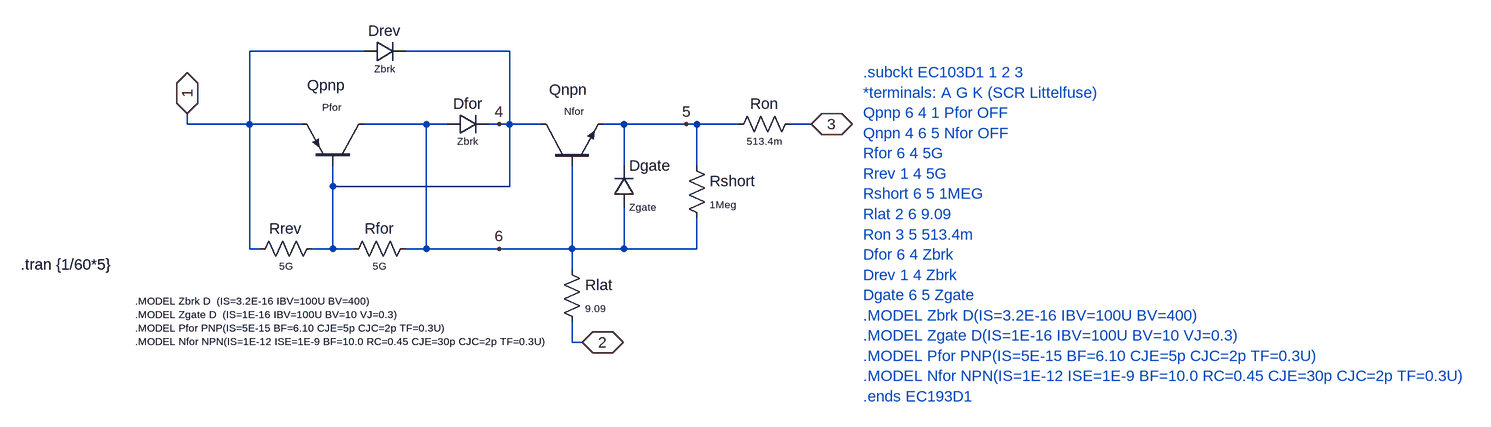
[diagram p0: schematic Littelfuse SCR EC103D1_Subckt.asc]
Littelfuse SCR EC103D1_Subckt.asc, the LTspice schematic file:
Version 4
SHEET 1 2028 680
WIRE 272 16 96 16
WIRE 496 16 336 16
WIRE 0 128 0 112
WIRE 96 128 96 16
WIRE 96 128 0 128
WIRE 176 128 96 128
WIRE 368 128 272 128
WIRE 400 128 368 128
WIRE 480 128 464 128
WIRE 496 128 496 16
WIRE 496 128 480 128
WIRE 544 128 496 128
WIRE 672 128 640 128
WIRE 768 128 672 128
WIRE 784 128 768 128
WIRE 848 128 784 128
WIRE 960 128 928 128
WIRE 672 192 672 128
WIRE 784 192 784 128
WIRE 224 224 224 192
WIRE 496 224 496 128
WIRE 496 224 224 224
WIRE 96 320 96 128
WIRE 112 320 96 320
WIRE 224 320 224 224
WIRE 224 320 192 320
WIRE 256 320 224 320
WIRE 368 320 368 128
WIRE 368 320 336 320
WIRE 480 320 368 320
WIRE 592 320 592 192
WIRE 592 320 480 320
WIRE 672 320 672 256
WIRE 672 320 592 320
WIRE 784 320 784 272
WIRE 784 320 672 320
WIRE 592 352 592 320
WIRE 592 464 592 432
WIRE 608 464 592 464
FLAG 0 112 1
IOPIN 0 112 BiDir
FLAG 480 320 6
FLAG 480 128 4
FLAG 768 128 5
FLAG 608 464 2
IOPIN 608 464 BiDir
FLAG 960 128 3
IOPIN 960 128 BiDir
SYMBOL pnp 272 192 M270
WINDOW 0 124 87 VLeft 2
WINDOW 3 90 64 VLeft 1
SYMATTR InstName Qpnp
SYMATTR Value Pfor
SYMBOL npn 544 192 R270
WINDOW 0 117 13 VRight 2
WINDOW 3 84 36 VRight 1
SYMATTR InstName Qnpn
SYMATTR Value Nfor
SYMBOL diode 400 144 R270
WINDOW 0 32 32 VTop 2
WINDOW 3 0 32 VBottom 1
SYMATTR InstName Dfor
SYMATTR Value Zbrk
SYMBOL res 944 112 R90
WINDOW 0 0 56 VBottom 2
WINDOW 3 32 56 VTop 1
SYMATTR InstName Ron
SYMATTR Value 513.4m
SYMBOL res 352 304 R90
WINDOW 0 0 56 VBottom 2
WINDOW 3 32 56 VTop 1
SYMATTR InstName Rfor
SYMATTR Value 5G
SYMBOL res 208 304 R90
WINDOW 0 0 56 VBottom 2
WINDOW 3 32 56 VTop 1
SYMATTR InstName Rrev
SYMATTR Value 5G
SYMBOL res 768 176 R0
WINDOW 3 36 76 Left 1
SYMATTR Value 1Meg
SYMATTR InstName Rshort
SYMBOL diode 656 256 M180
WINDOW 0 24 64 Left 2
WINDOW 3 24 0 Left 1
SYMATTR InstName Dgate
SYMATTR Value Zgate
SYMBOL res 576 336 R0
WINDOW 3 36 76 Left 1
SYMATTR Value 9.09
SYMATTR InstName Rlat
SYMBOL diode 272 32 R270
WINDOW 0 32 32 VTop 2
WINDOW 3 0 32 VBottom 1
SYMATTR InstName Drev
SYMATTR Value Zbrk
TEXT -80 400 Left 1 !.MODEL Zbrk D  (IS=3.2E-16 IBV=100U BV=400)\n.MODEL Zgate D  (IS=1E-16 IBV=100U BV=10 VJ=0.3)\n.MODEL Pfor PNP(IS=5E-15 BF=6.10 CJE=5p CJC=2p TF=0.3U)\n.MODEL Nfor NPN(IS=1E-12 ISE=1E-9 BF=10.0 RC=0.45 CJE=30p CJC=2p TF=0.3U)
TEXT -256 344 Left 2 !.tran {1/60*5}
TEXT 1040 48 Left 2 ;.subckt EC103D1 1 2 3\n*terminals: A G K (SCR Littelfuse)\nQpnp 6 4 1 Pfor OFF\nQnpn 4 6 5 Nfor OFF\nRfor 6 4 5G\nRrev 1 4 5G\nRshort 6 5 1MEG\nRlat 2 6 9.09\nRon 3 5 513.4m\nDfor 6 4 Zbrk\nDrev 1 4 Zbrk\nDgate 6 5 Zgate\n.MODEL Zbrk D(IS=3.2E-16 IBV=100U BV=400)\n.MODEL Zgate D(IS=1E-16 IBV=100U BV=10 VJ=0.3)\n.MODEL Pfor PNP(IS=5E-15 BF=6.10 CJE=5p CJC=2p TF=0.3U)\n.MODEL Nfor NPN(IS=1E-12 ISE=1E-9 BF=10.0 RC=0.45 CJE=30p CJC=2p TF=0.3U)\n.ends EC193D1

The netlist it stands for:
* Littelfuse SCR EC103D1_Subckt.asc
Qpnp 6 4 1 0 Pfor
Qnpn 4 6 5 0 Nfor
Dfor 6 4 Zbrk
Ron 3 5 513.4m
Rfor 6 4 5G
Rrev 4 1 5G
Rshort 5 6 1Meg
Dgate 6 5 Zgate
Rlat 6 2 9.09
Drev 1 4 Zbrk
.model D D
.lib standard.dio
.model NPN NPN
.model PNP PNP
.lib standard.bjt
.MODEL Zbrk D  (IS=3.2E-16 IBV=100U BV=400)
.MODEL Zgate D  (IS=1E-16 IBV=100U BV=10 VJ=0.3)
.MODEL Pfor PNP(IS=5E-15 BF=6.10 CJE=5p CJC=2p TF=0.3U)
.MODEL Nfor NPN(IS=1E-12 ISE=1E-9 BF=10.0 RC=0.45 CJE=30p CJC=2p TF=0.3U)
.tran {1/60*5}
* .subckt EC103D1 1 2 3
* *terminals: A G K (SCR Littelfuse)
* Qpnp 6 4 1 Pfor OFF
* Qnpn 4 6 5 Nfor OFF
* Rfor 6 4 5G
* Rrev 1 4 5G
* Rshort 6 5 1MEG
* Rlat 2 6 9.09
* Ron 3 5 513.4m
* Dfor 6 4 Zbrk
* Drev 1 4 Zbrk
* Dgate 6 5 Zgate
* .MODEL Zbrk D(IS=3.2E-16 IBV=100U BV=400)
* .MODEL Zgate D(IS=1E-16 IBV=100U BV=10 VJ=0.3)
* .MODEL Pfor PNP(IS=5E-15 BF=6.10 CJE=5p CJC=2p TF=0.3U)
* .MODEL Nfor NPN(IS=1E-12 ISE=1E-9 BF=10.0 RC=0.45 CJE=30p CJC=2p TF=0.3U)
* .ends EC193D1
.backanno
.end